# EAGLE design hw (EAGLE 9.1.3)
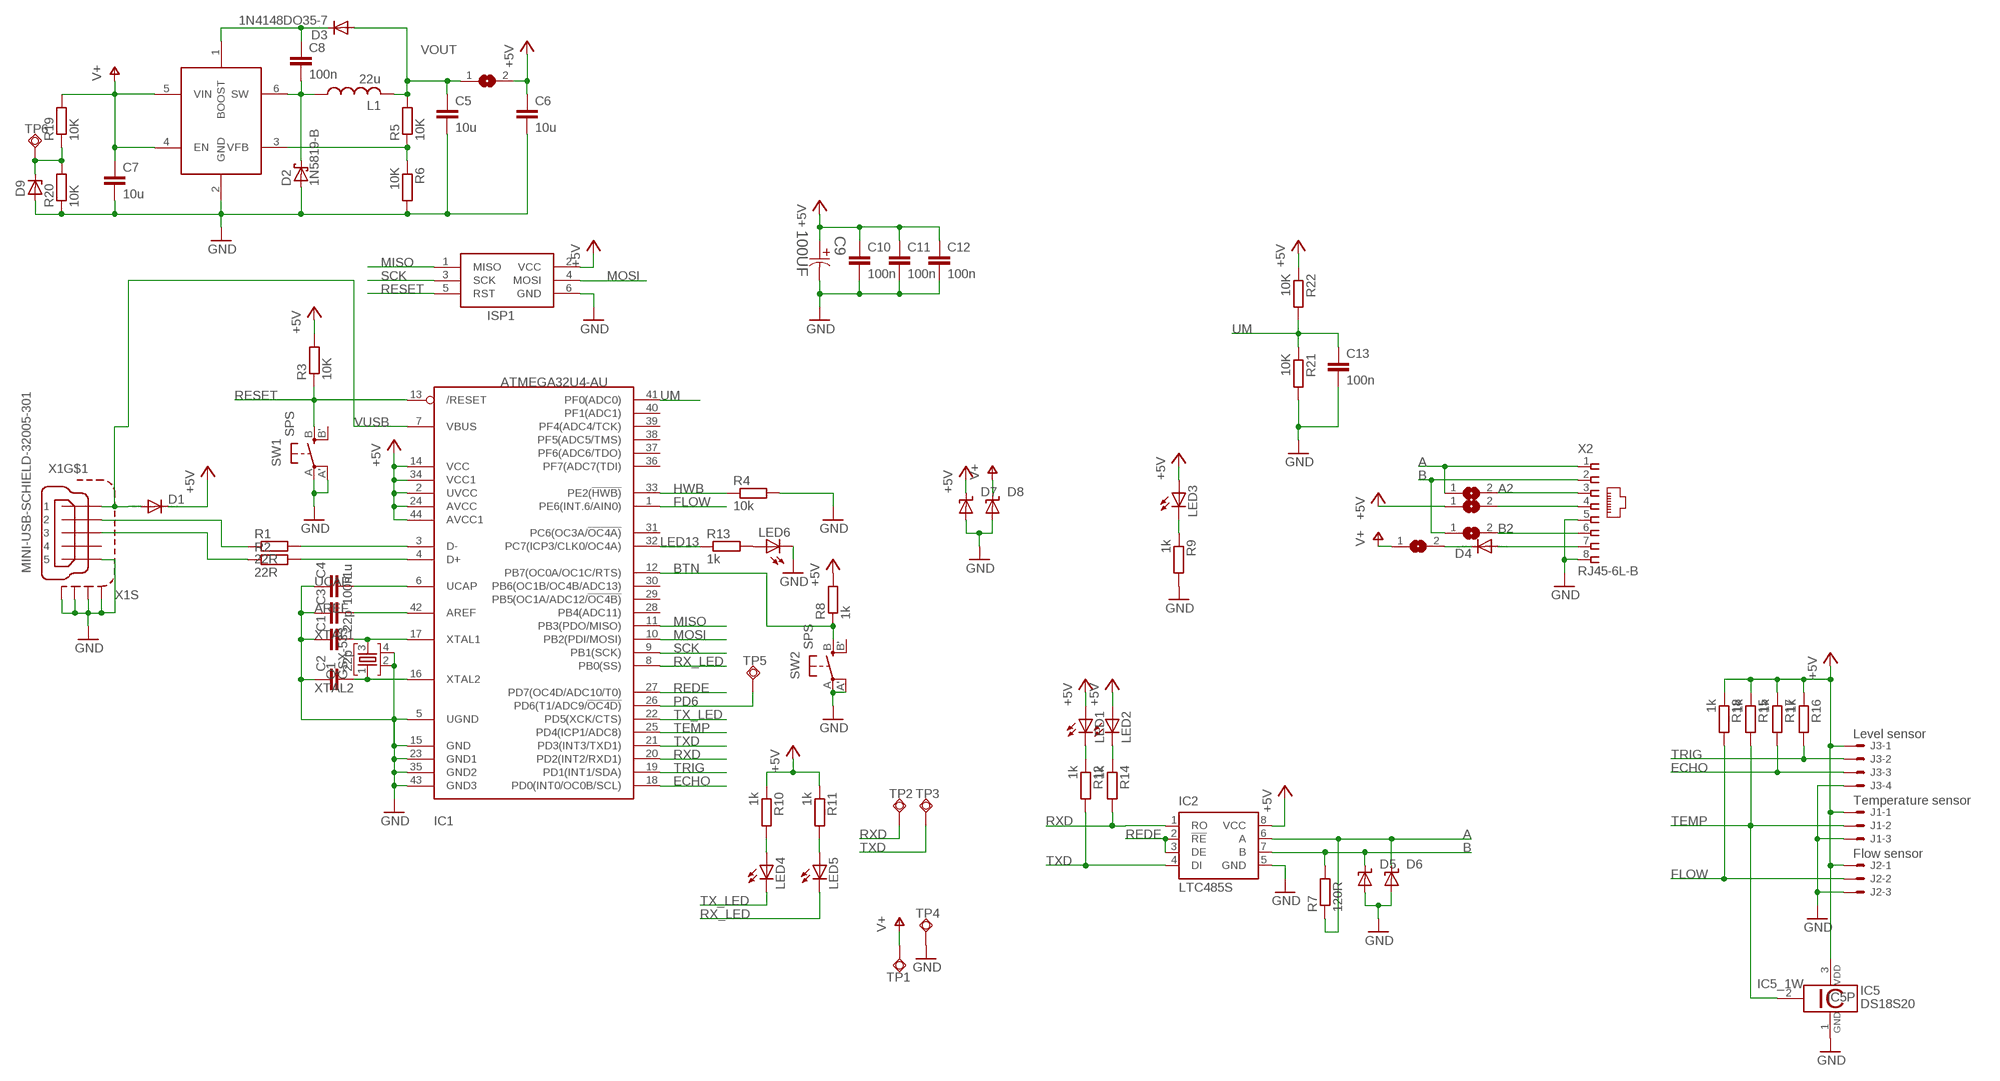
[diagram p0: schematic, sheet 1]

## Parts
C1  22p  C-EUC0805K  [C0805K]
C2  22p  C-EUC0805K  [C0805K]
C3  100n  C-EUC0805K  [C0805K]
C4  1u  C-EUC0805K  [C0805K]
C5  10u  C-EUC0805K  [C0805K]
C6  10u  C-EUC0805K  [C0805K]
C7  10u  C-EUC0805K  [C0805K]
C8  100n  C-EUC0805K  [C0805K]
C9  100UF  EEE-FK0J101AP-CASE-D  [CAPAE660X610N]
C10  100n  C-EUC0805K  [C0805K]
C11  100n  C-EUC0805K  [C0805K]
C12  100n  C-EUC0805K  [C0805K]
C13  100n  C-EUC0805K  [C0805K]
D1  DIODE-MICROMELF-W  [MICROMELF-W]
D2  1N5819-B  [DO41-7.6]
D3  1N4148DO35-7  [DO35-7]
D4  DIODE-MINIMELF  [MINIMELF]
D5  SUPPRESSOR-SMBG  [SMBG]
D6  SUPPRESSOR-SMBG  [SMBG]
D7  SUPPRESSOR-SMBG  [SMBG]
D8  SUPPRESSOR-SMBG  [SMBG]
D9  ZENER-DIODESMB  [SMB]
IC1  ATMEGA32U4-AU  [TQFP44]
IC2  LTC485S  [SOIC8]
IC3  MCP16301/H  [SOT23-6]
IC5  DS18S20  [TO92-]
ISP1  AVRISP-6  [AVRISP]
J1  Temperature sensor  22-27-2031-03  [6410-03]
J2  Flow sensor  22-27-2031-03  [6410-03]
J3  Level sensor  22-27-2041-04  [6410-04]
L1  22u  L-US0207/12  [0207/12]
LED1  LEDCHIPLED_0805  [CHIPLED_0805]
LED2  LEDCHIPLED_0805  [CHIPLED_0805]
LED3  LEDCHIPLED_0805  [CHIPLED_0805]
LED4  LEDCHIPLED_0805  [CHIPLED_0805]
LED5  LEDCHIPLED_0805  [CHIPLED_0805]
LED6  LEDCHIPLED_0805  [CHIPLED_0805]
Q1  GSX-533  [5032]
R1  22R  R-EU_M0805  [M0805]
R2  22R  R-EU_M0805  [M0805]
R3  10K  R-EU_M0805  [M0805]
R4  10k  R-EU_M0805  [M0805]
R5  10K  R-EU_M0805  [M0805]
R6  10K  R-EU_M0805  [M0805]
R7  120R  R-EU_M0805  [M0805]
R8  1k  R-EU_M0805  [M0805]
R9  1k  R-EU_M0805  [M0805]
R10  1k  R-EU_M0805  [M0805]
R11  1k  R-EU_M0805  [M0805]
R12  1k  R-EU_M0805  [M0805]
R13  1k  R-EU_M0805  [M0805]
R14  1k  R-EU_M0805  [M0805]
R15  1k  R-EU_M0805  [M0805]
R16  1k  R-EU_M0805  [M0805]
R17  1k  R-EU_M0805  [M0805]
R18  1k  R-EU_M0805  [M0805]
R19  10K  R-EU_M0805  [M0805]
R20  10K  R-EU_M0805  [M0805]
R21  10K  R-EU_M0805  [M0805]
R22  10K  R-EU_M0805  [M0805]
SJ1  SJ  [SJ]
SJ2  SJ  [SJ]
SJ3  SJ  [SJ]
SJ4  SJ  [SJ]
SJ5  SJ  [SJ]
SW1  SPS  SPST_TACT-EVQQ2  [EVQ-Q2]
SW2  SPS  SPST_TACT-EVQQ2  [EVQ-Q2]
TP1  TPSQTP20SQ  [TP20SQ]
TP2  TPSQTP20SQ  [TP20SQ]
TP3  TPSQTP20SQ  [TP20SQ]
TP4  TPSQTP20SQ  [TP20SQ]
TP5  TPSQTP20SQ  [TP20SQ]
TP6  TPSQTP20SQ  [TP20SQ]
X1  MINI-USB-SCHIELD-32005-301  [32005-301]
X2  RJ45-6L-B  [RJ45-NO-SHIELD]

## Nets
5V_IN: SJ4.2 X2.4
24V_IN: D4.A X2.7
+5V [Power]: C6.1 C9.1 C10.1 C11.1 C12.1 D1.C D7.C IC1.2(UVCC) IC1.14(VCC) IC1.24(AVCC) IC1.34(VCC1) IC1.44(AVCC1) IC2.8(VCC) IC5.3 ISP1.2(VCC) J1.1 J2.1 J3.1 LED1.A LED2.A LED3.A R3.2 R8.2 R10.1 R11.1 R15.1 R16.1 R17.1 R18.1 R22.1 SJ4.1 SJ5.2
A: D6.C IC2.6(A) R7.1 SJ1.1 X2.1
A2: SJ1.2 X2.3
AREF: C3.2 IC1.42(AREF)
B: D5.C IC2.7(B) R7.2 SJ2.1 X2.2
B2: SJ2.2 X2.6
BOOST: C8.1 D3.C IC3.1(BOOST)
BTN: IC1.12(PB7(OC0A/OC1C/RTS)) R8.1 SW2.B(S)
D+: IC1.4(D+) R2.2
D-: IC1.3(D-) R1.2
ECHO: IC1.18(PD0(INT0/OC0B/SCL)) J3.3 R17.2
FB: IC3.3(VFB) R5.1 R6.1
FLOW: IC1.1(PE6(INT.6/AIN0)) J2.2 R18.2
GND [Power]: C1.1 C2.1 C3.1 C4.1 C5.2 C6.2 C7.2 C9.2 C10.2 C11.2 C12.2 C13.2 D2.A D5.A D6.A D7.A D8.A D9.A IC1.5(UGND) IC1.15(GND) IC1.23(GND1) IC1.35(GND2) IC1.43(GND3) IC2.5(GND) IC3.2(GND) IC5.1 ISP1.6(GND) J1.3 J2.3 J3.4 LED6.C Q1.2(GND1) Q1.4(GND2) R4.2 R6.2 R9.2 R20.1 R21.2 SW1.A'(P1) SW1.A(P) SW2.A'(P1) SW2.A(P) TP4.TP X1.5 X1.M1(S:S1) X1.M2(S:S2) X1.M3(S:S3) X1.M4(S:S4) X2.5 X2.8
HWB: IC1.33(PE2(!HWB)) R4.1
LED13: IC1.32(PC7(ICP3/CLK0/OC4A)) R13.1
MISO: IC1.11(PB3(PDO/MISO)) ISP1.1(MISO)
MOSI: IC1.10(PB2(PDI/MOSI)) ISP1.4(MOSI)
N$1: LED4.A R10.2
N$2: LED5.A R11.2
N$4: D4.C SJ3.2
N$5: LED1.C R12.1
N$6: LED2.C R14.1
N$7: LED3.C R9.1
N$9: LED6.A R13.2
N$14: D9.C R19.1 R20.2 TP6.TP
PD6: IC1.26(PD6(T1/ADC9/!OC4D)) TP5.TP
REDE: IC1.27(PD7(OC4D/ADC10/T0)) IC2.2(!RE) IC2.3(DE)
RESET: IC1.13(/RESET) ISP1.5(RST) R3.1 SW1.B(S)
RX_LED: IC1.8(PB0(SS)) LED5.C
RXD: IC1.20(PD2(INT2/RXD1)) IC2.1(RO) R14.2 TP2.TP
SCK: IC1.9(PB1(SCK)) ISP1.3(SCK)
SW: C8.2 D2.C IC3.6(SW) L1.1
TEMP: IC1.25(PD4(ICP1/ADC8)) IC5.2 J1.2 R15.2
TRIG: IC1.19(PD1(INT1/SDA)) J3.2 R16.2
TX_LED: IC1.22(PD5(XCK/CTS)) LED4.C
TXD: IC1.21(PD3(INT3/TXD1)) IC2.4(DI) R12.2 TP3.TP
UCAP: C4.2 IC1.6(UCAP)
UM: C13.1 IC1.41(PF0(ADC0)) R21.1 R22.2
USB+: R2.1 X1.3
USB-: R1.1 X1.2
V+: C7.1 D8.C IC3.4(EN) IC3.5(VIN) R19.2 SJ3.1 TP1.TP
VOUT: C5.1 D3.A L1.2 R5.2 SJ5.1
VUSB: D1.A IC1.7(VBUS) X1.1
XTAL1: C1.2 IC1.17(XTAL1) Q1.3(XTAL2)
XTAL2: C2.2 IC1.16(XTAL2) Q1.1(XTAL1)
Unconnected: IC1.28(PB4(ADC11)) IC1.29(PB5(OC1A/ADC12/!OC4B)) IC1.30(PB6(OC1B/OC4B/ADC13)) IC1.31(PC6(OC3A/!OC4A)) IC1.36(PF7(ADC7(TDI)) IC1.37(PF6(ADC6/TDO)) IC1.38(PF5(ADC5/TMS)) IC1.39(PF4(ADC4/TCK)) IC1.40(PF1(ADC1)) SW1.B'(S1) SW2.B'(S1) X1.4

## Library data of the parts
C1-C6 C8 C10-C13 = rcl:C-EU: CAPACITOR, European symbol
C7 = rcl:C-EU: CAPACITOR, European symbol; SPICEPREFIX: C
C9 = Panasonic-EEEFK_EEEFP:EEE-: Aluminum Electrolytic Capacitors,Surface Mount Type; MPN: EEE-FK0J101AP; OC_FARNELL: 1244389; OC_NEWARK: 13M4887; PACKAGE: CASE-D; SUPPLIER: PANASONIC; TOLERANCE: ±20 %; VOLTAGERATING: 6.3V
D1 D4 = diode:DIODE-: DIODE
D2 = diode:1N581*: 1.0A SCHOTTKY BARRIER RECTIFIER Source: http://www.diodes.com/datasheets/ds23001.pdf
D3 = diode:1N4148: DIODE high speed (Philips)
D5-D8 = diode:SUPPRESSOR-: Suppressor diode
D9 = diode:ZENER-DIODE: Z-Diode
IC1 = adafruit2:ATMEGA32U4: http://www.ladyada.net/library/eagle
IC2 = linear-technology:LTC485: Low Power RS485 Interface Transceiver Source: http://www.linear.com/pc/downloadDocument.do?navId=H0,C1,C1007,C1017,P2064,D1718; OC_FARNELL: unknown; OC_NEWARK: unknown
IC3 = MCP16301:MCP16301/H: High-Voltage Input Integrated Switch Step-Down Regulator
IC5 = 1wire:DS18S20: High Precision Digital Thermometer This chip provides a onewire thermosensor with approx. 0.5°C accuracy.A programmable over/undertemperure alarm is available. Notes: Vdd must be applied for accurate measurements at low temperatures, as the parasite power circuit otherwise heats the sensor. If parasite power is used, Vdd has to be connected to GND. The DS1822 is a low-cost thermometer chip, the DS18B20 is similar to the DS18S20, but with 9..12 Bit programmable precision. Author: Jan Kandziora <jjj@gmx.de>; SPICEPREFIX: X
ISP1 = adafruit:AVRISP: AVR ISP HEADER Standard 6 pin header for AVR programming
J1 J2 = con-molex:22-?-03: CONNECTOR wire to board 2.54 mm (.1 inch) pitch header; MF: MOLEX; OC_FARNELL: unknown; OC_NEWARK: unknown
J3 = con-molex:22-?-04: CONNECTOR wire to board 2.54 mm (.1 inch) pitch header; MF: MOLEX; OC_FARNELL: unknown; OC_NEWARK: unknown
L1 = rcl:L-US: INDUCTOR, American symbol; SPICEPREFIX: L
LED1-LED6 = led:LED: LED OSRAM: - CHIPLED LG R971, LG N971, LY N971, LG Q971, LY Q971, LO R971, LY R971 LH N974, LH R974 LS Q976, LO Q976, LY Q976 LO Q996 - Hyper CHIPLED LW Q18S LB Q993, LB Q99A, LB R99A - SideLED LS A670, LO A670, LY A670, LG A670, LP A670 LB A673, LV A673, LT A673, LW A673 LH A674 LY A675 LS A676, LA A676, LO A676, LY A676, LW A676 LS A679, LY A679, LG A679 - Hyper Micro SIDELED® LS Y876, LA Y876, LO Y876, LY Y876 LT Y87S - SmartLED LW L88C, LW L88S LB L89C, LB L89S, LG L890 LS L89K, LO L89K, LY L89K LS L896, LA L896, LO L896, LY L896 - TOPLED LS T670, LO T670, LY T670, LG T670, LP T670 LSG T670, LSP T670, LSY T670, LOP T670, LYG T670 LG T671, LOG T671, LSG T671 LB T673, LV T673, LT T673, LW T673 LH T674 LS T676, LA T676, LO T676, LY T676, LB T676, LH T676, LSB T676, LW T676 LB T67C, LV T67C, LT T67C, LS T67K, LO T67K, LY T67K, LW E67C LS E67B, LA E67B, LO E67B, LY E67B, LB E67C, LV E67C, LT E67C LW T67C LS T679, LY T679, LG T679 LS T770, LO T770, LY T770, LG T770, LP T770 LB T773, LV T773, LT T773, LW T773 LH T774 LS E675, LA E675, LY E675, LS T675 LS T776, LA T776, LO T776, LY T776, LB T776 LHGB T686 LT T68C, LB T68C - Hyper Mini TOPLED® LB M676 - Mini TOPLED Santana® LG M470 LS M47K, LO M47K, LY M47K Source: http://www.osram.convergy.de LUXEON: - LUMILED® LXK2-PW12-R00, LXK2-PW12-S00, LXK2-PW14-U00, LXK2-PW14-V00 LXK2-PM12-R00, LXK2-PM12-S00, LXK2-PM14-U00 LXK2-PE12-Q00, LXK2-PE12-R00, LXK2-PE12-S00, LXK2-PE14-T00, LXK2-PE14-U00 LXK2-PB12-K00, LXK2-PB12-L00, LXK2-PB12-M00, LXK2-PB14-N00, LXK2-PB14-P00, LXK2-PB14-Q00 LXK2-PR12-L00, LXK2-PR12-M00, LXK2-PR14-Q00, LXK2-PR14-R00 LXK2-PD12-Q00, LXK2-PD12-R00, LXK2-PD12-S00 LXK2-PH12-R00, LXK2-PH12-S00 LXK2-PL12-P00, LXK2-PL12-Q00, LXK2-PL12-R00 Source: www.luxeon.com KINGBRIGHT: KA-3528ASYC Source: www.kingbright.com
Q1 = crystal-golledge:GSX-533
R1-R22 = rcl:R-EU_: RESISTOR, European symbol
SJ1-SJ5 = jumper:SJ: SMD solder JUMPER
SW1 SW2 = adafruit:SPST_TACT: SMT 6mm switch, EVQQ2 series http://www.ladyada.net/library/eagle
TP1-TP6 = testpad:TPSQ: Test pad
X1 = con-cypressindustries:MINI-USB-SCHIELD-: MINI USB-B Conector Source: www.cypressindustries.com; OC_FARNELL: unknown; OC_NEWARK: unknown
X2 = con-tycoelectronics:RJ45: CORCOM Modular RJ Jacks No Shield Source: www.tycoelectronics.com .. ENG_DS_1654001_1099_RJ_L_0507.pdf; MPN: RJ45-6L-B; OC_FARNELL: unknown; OC_NEWARK: 16R6090

## Net classes
0 Signal: width 0.406 mm, drill 0.3 mm
1 Power: width 0.508 mm, drill 0.4 mm

## Board
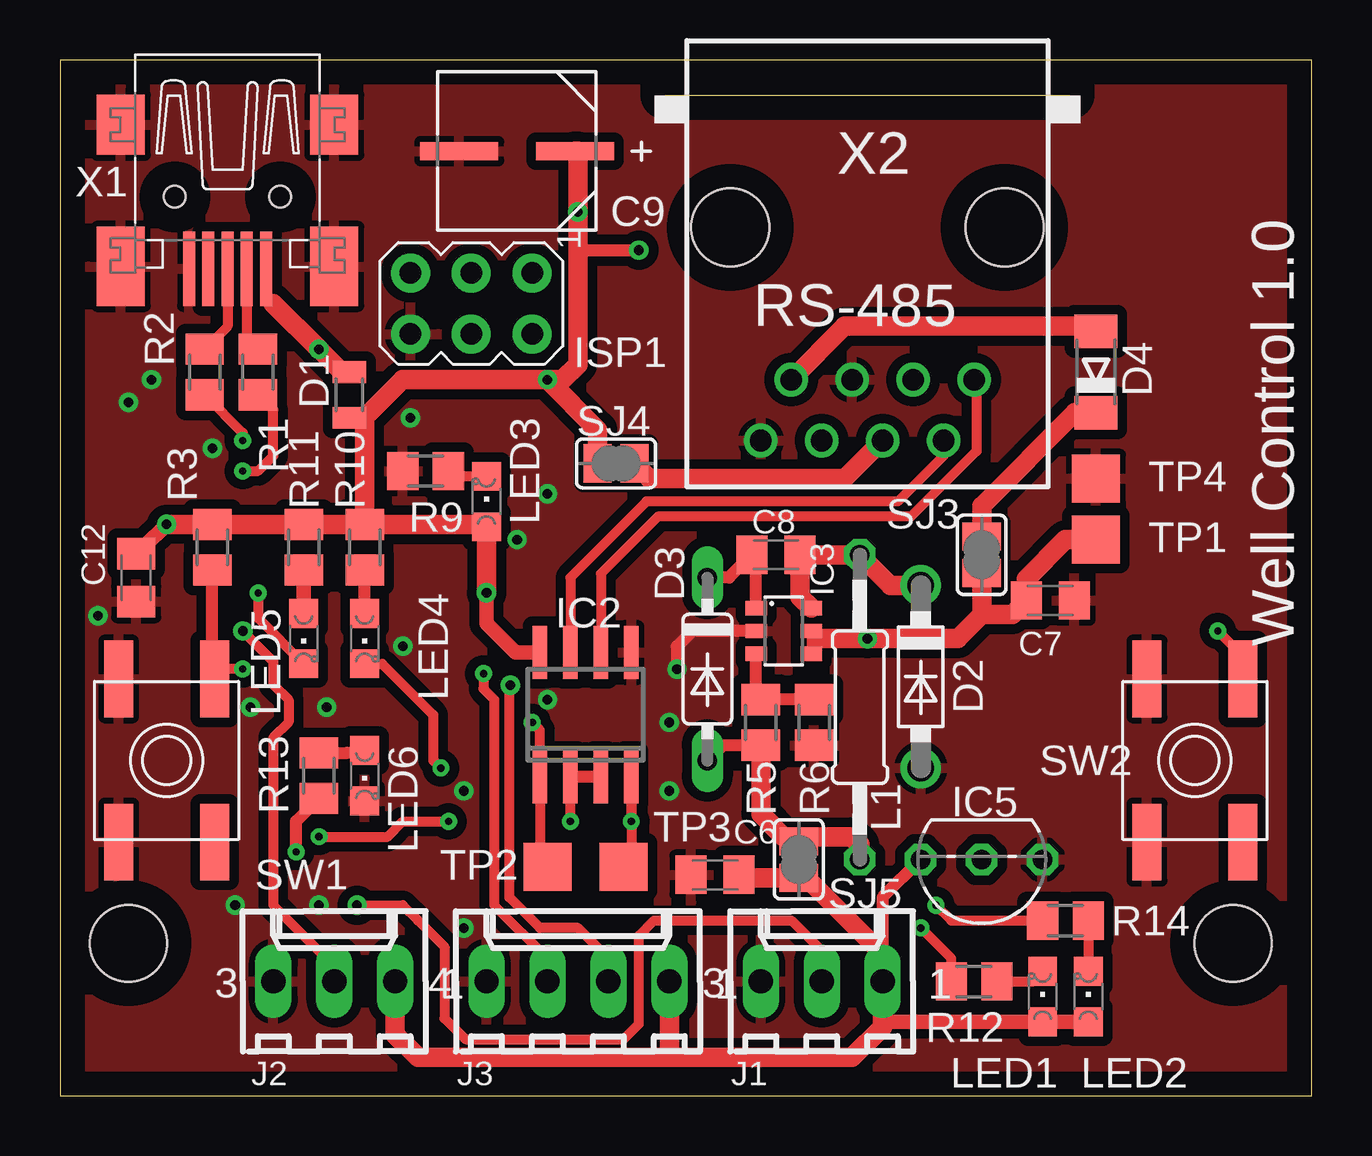
[diagram p1: board, top side]
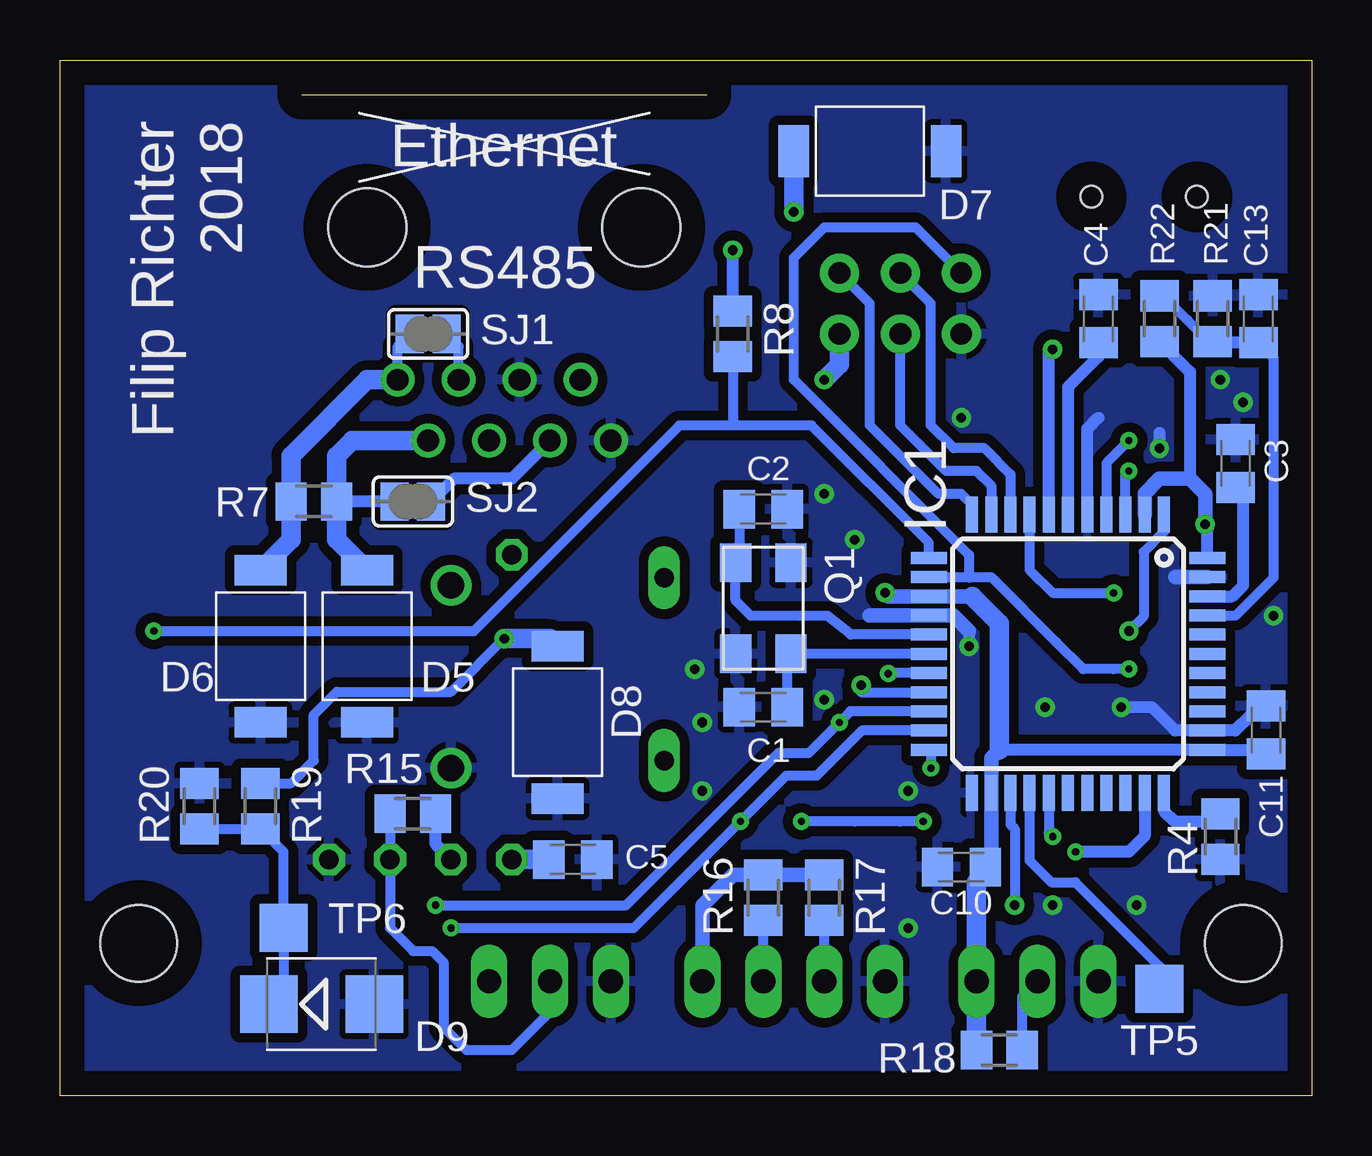
[diagram p2: board, bottom side, seen from below]

Size 52.17 x 43.17 mm. Coordinates in mm from the lower left corner, seen from the top.
Outline: 0,0 52.17,0 52.17,43.17 0,43.17 0,0
Copper layers (1*16): Top 0.0347mm / dielectric 1.5306mm / Bottom 0.0347mm
Design rules "AllPCB": minimum track width 6mil, minimum drill 0.3mm, track to track 6mil, track to pad 6mil, pad to pad 6mil, via to via 6mil, smd to smd 6mil, copper to edge 40mil, drill to drill 8mil, minimum pad ring 10mil, minimum via ring 8mil, stop-mask expansion 4mil, vias tented up to drill 0mil, thermal gap 10mil
Holes 3.2 mm at 2.86,6.35 48.9,6.35

### Footprints (pad centres in the part's own frame; a part is rotated, then mirrored left to right if it is on the bottom)
C0805K = smd 1.3 x 1.6: 1 -1,0; 2 1,0
CAPAE660X610N = smd 3.251 x 0.762: 1 -2.413,0; 2 2.413,0
MICROMELF-W = smd 0.9 x 1.4: A 0.95,0; C -0.95,0
DO41-7.6 = drill 1.1 pad 1.7: A 3.81,0; C -3.81,0
DO35-7 = drill 0.813 long: A 3.81,0; C -3.81,0
MINIMELF = smd 1.4 x 1.8: A 1.7,0; C -1.7,0
SMBG = smd 1.27 x 2.16: A 3.17,0; C -3.17,0
SMB = smd 2.4 x 2.4: A 2.2,0; C -2.2,0
TQFP44 = smd 1.5 x 0.5: 1 -5.8,4; 2 -5.8,3.2; 3 -5.8,2.4; 4 -5.8,1.6; 5 -5.8,0.8; 6 -5.8,0; 7 -5.8,-0.8; 8 -5.8,-1.6; 9 -5.8,-2.4; 10 -5.8,-3.2; 11 -5.8,-4; 23 5.8,-4; 24 5.8,-3.2; 25 5.8,-2.4; 26 5.8,-1.6; 27 5.8,-0.8; 28 5.8,0; 29 5.8,0.8; 30 5.8,1.6; 31 5.8,2.4; 32 5.8,3.2; 33 5.8,4 | smd 0.5 x 1.5: 12 -4,-5.8; 13 -3.2,-5.8; 14 -2.4,-5.8; 15 -1.6,-5.8; 16 -0.8,-5.8; 17 0,-5.8; 18 0.8,-5.8; 19 1.6,-5.8; 20 2.4,-5.8; 21 3.2,-5.8; 22 4,-5.8; 34 4,5.8; 35 3.2,5.8; 36 2.4,5.8; 37 1.6,5.8; 38 0.8,5.8; 39 0,5.8; 40 -0.8,5.8; 41 -1.6,5.8; 42 -2.4,5.8; 43 -3.2,5.8; 44 -4,5.8
SOIC8 = smd 0.6 x 2.2: 1 -1.905,-2.6; 2 -0.635,-2.6; 3 0.635,-2.6; 4 1.905,-2.6; 5 1.905,2.6; 6 0.635,2.6; 7 -0.635,2.6; 8 -1.905,2.6
SOT23-6 = smd 0.6 x 0.9: 1 -0.95,-1.15; 2 0,-1.15; 3 0.95,-1.15; 4 0.95,1.15; 5 0,1.15; 6 -0.95,1.15
TO92- = drill 0.813 octagon: 1 -2.54,0; 2 0,0; 3 2.54,0
AVRISP = drill 0.9 pad 1.626: 1 -1.27,2.54; 2 1.27,2.54; 3 -1.27,0; 4 1.27,0; 5 -1.27,-2.54; 6 1.27,-2.54
6410-03 = drill 1.016 long: 1 2.54,0; 2 0,0; 3 -2.54,0
6410-04 = drill 1.016 long: 1 3.81,0; 2 1.27,0; 3 -1.27,0; 4 -3.81,0
0207/12 = drill 0.813 octagon: 1 -6.35,0; 2 6.35,0
CHIPLED_0805 = smd 1.2 x 1.2: A 0,-1.05; C 0,1.05
5032 = smd 1.6 x 1.3: 1 -1.9,-1.15; 2 1.9,-1.15; 3 1.9,1.15; 4 -1.9,1.15
M0805 = smd 1.3 x 1.6: 1 -0.95,0; 2 0.95,0
SJ = smd 1.168 x 1.6: 1 -0.762,0; 2 0.762,0
EVQ-Q2 = smd 3.2 x 1.2: A -3.4,-2; A' 3.4,-2; B -3.4,2; B' 3.4,2
TP20SQ = smd 2 x 2: TP 0,0
32005-301 = smd 3.1 x 0.5: 1 3,1.6; 2 3,0.8; 3 3,0; 4 3,-0.8; 5 3,-1.6 | smd 2.5 x 2: M1 -3,-4.45; M2 -3,4.45 | smd 3.3 x 2: M3 2.9,4.45; M4 2.9,-4.45 | hole 0.9: 0,2.2; 0,-2.2
RJ45-NO-SHIELD = drill 0.9 pad 1.4: 1 -4.445,6.35; 2 -3.175,8.89; 3 -1.905,6.35; 4 -0.635,8.89; 5 0.635,6.35; 6 1.905,8.89; 7 3.175,6.35; 8 4.445,8.89 | hole 3.251: -5.715,0; 5.715,0

### Placement (x,y rotation side)
C1  22.86,16.19 0 bottom
C2  22.86,24.45 180 bottom
C3  3.17,26.35 270 bottom
C4  8.89,32.38 270 bottom
C5  30.8,9.84 0 bottom
C6  27.3,9.21 180 top
C7  41.27,20.64 0 top
C8  29.84,22.54 0 top
C9  19.05,39.37 180 top
C10  14.61,9.53 180 bottom
C11  1.91,15.24 90 bottom
C12  3.17,21.59 270 top
C13  2.22,32.38 90 bottom
D1  12.06,29.21 90 top
D2  35.88,17.46 270 top
D3  26.99,17.78 270 top
D4  43.18,30.16 90 top
D5  39.37,18.73 270 bottom
D6  43.81,18.73 270 bottom
D7  18.41,39.37 0 bottom
D8  31.43,15.56 270 bottom
D9  41.27,3.81 0 bottom
IC1  10.16,18.41 270 bottom
IC2  21.91,15.88 0 top
IC3  30.16,19.37 270 top
IC5  38.42,9.84 180 top
ISP1  17.14,33.02 270 top
J1  31.75,4.76 0 top
J2  11.43,4.76 0 top
J3  21.59,4.76 0 top
L1  33.34,16.19 270 top
LED1  40.96,4.13 0 top
LED2  42.86,4.13 0 top
LED3  17.78,24.77 0 top
LED4  12.7,19.05 180 top
LED5  10.16,19.05 180 top
LED6  12.7,13.34 180 top
Q1  22.86,20.32 270 bottom
R1  8.26,30.16 270 top
R2  6.03,30.16 270 top
R3  6.35,22.86 90 top
R4  3.81,10.79 270 bottom
R5  29.21,15.56 270 top
R6  31.43,15.56 270 top
R7  41.59,24.77 0 bottom
R8  24.13,31.75 90 bottom
R9  15.24,26.04 180 top
R10  12.7,22.86 270 top
R11  10.16,22.86 270 top
R12  38.1,4.76 180 top
R13  10.79,13.34 90 top
R14  41.91,7.3 180 top
R15  37.47,11.75 180 bottom
R16  22.86,8.26 270 bottom
R17  20.32,8.26 270 bottom
R18  13.02,1.91 0 bottom
R19  43.81,12.07 90 bottom
R20  46.35,12.07 270 bottom
R21  4.13,32.38 90 bottom
R22  6.35,32.38 90 bottom
SJ1  36.83,31.75 0 bottom
SJ2  37.47,24.77 0 bottom
SJ3  38.42,22.54 90 top
SJ4  23.18,26.35 0 top
SJ5  30.8,9.84 270 top
SW1  4.45,13.97 270 top
SW2  47.31,13.97 270 top
TP1  43.18,23.18 0 top
TP2  20.32,9.53 0 top
TP3  23.5,9.53 0 top
TP4  43.18,25.72 0 top
TP5  6.35,4.45 0 bottom
TP6  42.86,6.99 0 bottom
X1  6.99,37.47 270 top
X2  33.66,36.2 180 top

### Tracks (layer width: path | path; a pad name or v marks a point on that pad's centre or on a via)
5V_IN
  Top 0.813: SJ4.2 24.57,25.72 32.7,25.72 X2.4
24V_IN
  Top 0.813: X2.7 32.7,32.07 42.98,32.07 D4.A
+5V  (via drill 0.4, 0.4 pad 0.81)
  Top 0.508: 21.59,35.24 v24.13,35.24 | IC5.3 34.29,8.26 34.29,5.91
  Top 0.61: C12.1 3.49,22.86 v4.45,23.81 | IC2.8 18.99,18.48 17.78,19.68 v17.78,20.96 | LED2.A LED1.A 34.39,3.08 34.29,3.18 J1.1
  Top 0.813: v20.32,29.84 14.29,29.84 12.7,28.26 | R10.1 R11.1 R3.2 v4.45,23.81 | v20.32,29.84 20.95,29.84 21.59,30.48 21.59,35.24 v21.59,36.83 D7.C C9.1 | D1.C 12.7,28.26 | R10.1 12.7,28.26 | SJ4.1 22.42,27.75 v20.32,29.84 | R10.1 17.78,23.81 | 17.78,23.81 v17.78,20.96 | 25.4,1.59 14.92,1.59 13.97,2.54 J2.1 | J3.1 25.4,2.54 25.4,1.59 | 25.4,1.59 33.02,1.59 34.29,2.86 J1.1 34.29,5.59 34.29,5.91 31.11,9.08 SJ5.2 28.43,9.08 C6.1 | LED3.A 17.78,23.81
  Bottom 0.508: IC1.44 4.36,23.73 | 13.36,9.77 C10.1 | C11.1 2.08,14.41 IC1.34 13.02,14.41 | R8.2 v24.13,35.24 | IC5.3 36.52,10.48 R15.1 | 5.08,25.72 5.08,27.75 5.08,30.16 R22.1
  Bottom 0.61: 4.36,23.73 v4.45,23.81 4.45,25.08 5.08,25.72 6.35,25.72 6.96,25.11 IC1.2 | 14.15,20.82 IC1.14 17.64,20.82 v17.78,20.96 | 13.36,9.77 IC1.24 13.36,14.07 13.02,14.41 | R18.1 13.97,2.22 | R17.1 R16.1 24.13,9.21 25.4,7.94 J3.1
  Bottom 0.813: v20.32,29.84 19.68,30.48 ISP1.2 | 14.15,20.82 13.02,19.68 13.02,14.41 | C10.1 13.61,9.26 13.97,8.89 J2.1 13.97,2.22 | D7.C v21.59,36.83
A
  Top 0.406: IC2.6 22.54,21.76 24.92,24.13 35.47,24.13 38.2,26.87 38.2,29.74 X2.1
  Bottom 0.406: X2.1 38.1,31.24 SJ1.1 | R7.1
  Bottom 0.813: X2.1 39.37,29.84 42.55,26.67 42.55,25.4 R7.1 42.55,23.17 D6.C
A2
  Bottom 0.406: X2.3 35.56,31.24 SJ1.2
AREF
  Bottom 0.508: IC1.42 3.31,20.82 2.86,21.27 2.86,25.04 C3.2
B
  Top 0.406: IC2.7 21.27,21.59 24.45,24.77 34.92,24.77 36.83,26.67 X2.2
  Bottom 0.406: R7.2 | X2.2 36.67,27.15 X2.2
  Bottom 0.508: SJ2.1 R7.2
  Bottom 0.813: X2.2 40.01,27.3 40.64,26.67 40.64,25.08 R7.2 40.64,23.17 D5.C
B2
  Bottom 0.508: X2.6 33.34,25.72 35.75,25.72 SJ2.2
BOOST
  Top 0.508: D3.C 27.89,21.59 C8.1 29.01,22.38 IC3.1
BTN  (via drill 0.3)
  Top 0.406: v48.26,19.37 49.31,18.32 SW2.B
  Bottom 0.406: 24.13,27.94 20.85,27.94 15.96,23.05 IC1.12 | 24.13,27.94 26.35,27.94 34.92,19.37 v48.26,19.37 | R8.1 24.13,27.94
D+  (via drill 0.3 pad 0.61)
  Top 0.406: R2.2 7.62,27.62 v7.62,27.3
  Bottom 0.406: v7.62,27.3 8.56,26.36 IC1.4
D-  (via drill 0.3 pad 0.61)
  Top 0.406: R1.2 8.89,28.58 8.89,26.67 8.26,26.04 v7.62,26.04
  Bottom 0.406: IC1.3 7.76,25.89 v7.62,26.04
ECHO  (via drill 0.3)
  Top 0.406: J3.3 20.32,5.71 18.1,7.94 18.1,16.51 17.65,16.96 v17.65,17.59
  Bottom 0.406: IC1.18 17.63,17.62 v17.65,17.59 | J3.3 R17.2
FB
  Top 0.508: R6.1 R5.1 29.01,16.71 IC3.3
FLOW  (via drill 0.4)
  Top 0.406: v7.62,19.37 8.89,18.1 8.89,17.14 9.53,16.51 9.53,15.56 8.89,14.92 8.89,7.94 11.43,5.4 J2.2
  Bottom 0.406: IC1.1 6.16,23.51 7.01,22.66 7.01,19.98 v7.62,19.37 | R18.2 12.07,4.12 J2.2
GND  (via drill 0.4)
  Top 0.508: IC3.2 26.35,19.37 25.72,18.73 v25.72,17.78
  Bottom 0.508: C11.2 2.27,15.88 2.54,15.88 3.2,15.21 IC1.35 5.69,15.21 6.67,16.19 v7.94,16.19 | 14.94,20.02 IC1.15 | 14.29,19.37 v14.29,18.73 | 6.35,27.62 v6.35,26.99 | IC1.5 9.36,27.79 8.89,28.26
  Bottom 0.61: 14.29,19.37 14.94,20.02 IC1.15 18.43,20.02 | IC1.43 5.69,21.62
  other vias: 20.32,25.08 25.4,12.7 19.05,23.18 20.32,16.51 25.4,15.56 14.61,28.26 11.11,16.19 7.3,7.94 16.83,12.7 16.83,6.99 10.79,7.94 1.59,20 2.86,28.89 3.81,29.84
  pour Top (isolate 0.406): 52.07,43.18 0,43.18 0,0 52.07,0
  pour Bottom (isolate 0.406): 0,43.18 52.07,43.18 52.07,0 0,0
HWB
  Bottom 0.508: IC1.33 6.16,11.88 5.71,11.43 3.49,11.43 R4.1
LED13  (via drill 0.3)
  Top 0.508: v9.84,10.16 9.84,11.43 R13.1
  Bottom 0.508: IC1.32 6.96,10.82 7.62,10.16 v9.84,10.16
MISO
  Bottom 0.406: ISP1.1 18.41,33.02 18.41,27.94 15.56,25.08 14.61,25.08 14.16,24.64 IC1.11
MOSI
  Bottom 0.406: ISP1.4 17.14,27.94 15.24,26.04 13.97,26.04 13.36,25.43 IC1.10
N$1
  Top 0.508: LED4.A R10.2
N$2
  Top 0.61: LED5.A R11.2
N$4
  Top 0.813: SJ3.2 38.42,24.57 42.31,28.46 D4.C
N$5
  Top 0.406: R12.1 40.54,4.76 LED1.C
N$6
  Top 0.406: R14.1 42.86,6.67 LED2.C
N$7
  Top 0.406: R9.1 16.41,25.81 LED3.C
N$9
  Top 0.508: R13.2 11.96,14.29 LED6.A
N$14
  Bottom 0.406: R20.2 R19.1 42.86,10.16 TP6.TP 42.86,4.17 43.2,3.83 D9.C
PD6
  Bottom 0.406: IC1.26 11.76,9.8 10.85,8.89 9.84,8.89 6.35,5.4 TP5.TP | TP5.TP 6.4,4.45 TP5.TP
REDE  (via drill 0.3)
  Top 0.406: v10.79,10.79 13.65,10.79 14.29,11.43 v16.19,11.43 | v21.27,11.43 IC2.2
  Top 0.508: IC2.3 IC2.2
  Bottom 0.406: IC1.27 10.96,10.96 v10.79,10.79 | v21.27,11.43 19.05,11.43 17.14,11.43 v16.19,11.43
RESET  (via drill 0.3 pad 0.61)
  Top 0.406: SW1.B 6.35,17.46 6.35,17.78 | 6.35,17.78 6.35,18.41 | v7.62,17.78 6.35,17.78
  Top 0.508: 6.35,18.41 R3.1
  Bottom 0.406: ISP1.5 16.51,36.2 20.32,36.2 21.59,34.93 21.59,29.84 14.29,22.54 14.29,21.59 15.94,21.59 IC1.13 13.36,21.62 10.64,18.89 9.53,17.78 8.26,17.78 v7.62,17.78
RX_LED  (via drill 0.3 pad 0.61)
  Top 0.406: v8.26,20.96 8.26,19.91 LED5.C
  Bottom 0.406: IC1.8 11.76,21.92 10.79,20.96 v8.26,20.96
RXD  (via drill 0.3)
  Top 0.406: TP2.TP 20,9.84 IC2.1 20,15.24 v19.68,15.56 | R14.2 37.15,7.3 v36.51,7.94
  Bottom 0.406: IC1.20 19.23,16.02 | 19.23,16.02 v19.68,15.56 | v36.51,7.94 28.57,7.94 22.23,14.29 20.95,14.29 19.23,16.02
SCK
  Bottom 0.406: ISP1.3 15.88,33.02 15.88,28.89 15.88,27.94 14.92,26.99 13.65,26.99 12.56,25.89 IC1.9
SW
  Top 0.813: D2.C 34.61,21.27 L1.1 C8.2 30.84,20.79 IC3.6
TEMP  (via drill 0.4)
  Top 0.406: J1.2 31.75,6.03 30.48,7.3 24.77,7.3 24.13,6.67 24.13,2.99 23.5,2.35 16.9,2.35 16.03,3.22 16.03,6.2 14.92,7.3 14.29,7.94 v12.38,7.94
  Bottom 0.406: IC1.25 12.56,11.29 12.38,11.11 v12.38,7.94 | J1.2 31.75,3.49 33.34,1.91 35.24,1.91 36.2,2.86 36.2,5.56 36.67,6.03 37.47,6.03 38.42,6.99 IC5.2 R15.2
TRIG  (via drill 0.4)
  Top 0.406: J3.2 22.86,5.71 21.59,6.99 20,6.99 18.73,8.26 18.73,17.07 v18.77,17.11
  Bottom 0.406: v18.77,17.11 18.77,16.82 IC1.19 | J3.2 R16.2
TX_LED  (via drill 0.3 pad 0.61)
  Top 0.406: LED4.C 13.43,18 15.56,15.88 15.56,13.97 v15.88,13.65
  Bottom 0.406: v15.88,13.65 15.88,14.33 IC1.22
TXD  (via drill 0.3)
  Top 0.406: TP3.TP 23.81,9.84 IC2.4 v23.81,11.43 | v35.88,6.99 37.15,5.71 R12.2
  Bottom 0.406: IC1.21 18.76,15.21 20.64,13.34 21.91,13.34 v23.81,11.43 26.19,9.05 28.26,6.99 v35.88,6.99
UCAP
  Bottom 0.508: IC1.6 10.16,29.53 8.89,30.8 C4.2
UM
  Bottom 0.406: R22.2 6.18,33.34 5.18,32.33 4.23,31.38 | IC1.41 3.16,20.02 1.59,21.59 1.59,30.75 C13.1
  Bottom 0.508: 4.08,31.38 4.23,31.38 | 4.08,31.38 R21.1 | C13.1 4.08,31.38
USB+
  Top 0.406: X1.3 6.99,32.06 R2.1
USB-
  Top 0.406: X1.2 7.79,31.58 R1.1
V+  (via drill 0.4)
  Top 0.406: 31.75,19.05 31.63,19.05 IC3.5 IC3.4
  Top 0.813: 31.75,19.05 v33.66,19.05 34.92,19.05 37.42,19.05 38.42,20.05 | 38.42,20.05 SJ3.1 | TP1.TP 41.91,23.18 40.27,21.54 C7.1 39.69,20.05 38.42,20.05
  Bottom 0.406: v33.66,19.05 35.88,16.83 40.64,16.83 41.59,15.88 41.59,13.97 42.55,13.02 R19.2
  Bottom 0.813: D8.C 31.75,19.05 v33.66,19.05
VOUT
  Top 0.508: R5.2 27.62,14.61 D3.A
  Top 0.813: R5.2 29.21,11.75 30.16,10.79 30.8,10.79 | 30.8,10.79 33.02,10.79 33.34,10.48 L1.2 | SJ5.1 30.8,10.79
  Bottom 0.813: C5.1 L1.2
VUSB  (via drill 0.4 pad 0.61)
  Top 0.508: X1.1 8.59,33.33 8.89,33.02
  Top 0.813: 8.89,33.02 v10.8,31.11 11.75,30.16 D1.A
  Bottom 0.508: IC1.7 10.96,30.95 v10.8,31.11
XTAL1
  Bottom 0.406: IC1.17 19.68,18.41 19.69,18.42 Q1.3 21.86,18.27 C1.2
XTAL2
  Bottom 0.406: IC1.16 19.21,19.21 20.18,20 23.38,20 24.01,20.63 Q1.1 23.86,22.37 C2.2

### Text on the board
tNames: RS-485 | Well Control 1.0
bNames: 2018 | Filip Richter | Ethernet | RS485